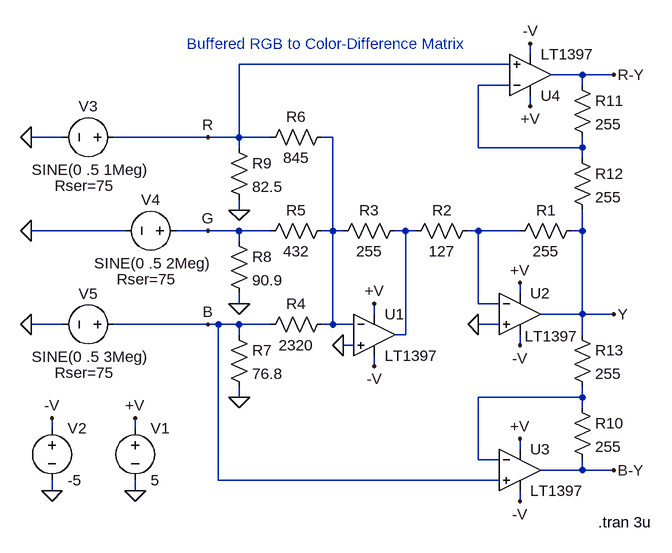
[diagram p0: schematic 1397.asc]
1397.asc, the LTspice schematic file:
Version 4
SHEET 1 1020 776
WIRE 400 -32 400 -48
WIRE 368 -16 -48 -16
WIRE 480 0 432 0
WIRE 528 0 480 0
WIRE 368 16 320 16
WIRE 480 16 480 0
WIRE 400 48 400 32
WIRE -320 96 -368 96
WIRE -96 96 -240 96
WIRE -48 96 -48 -16
WIRE -48 96 -96 96
WIRE 0 96 -48 96
WIRE 96 96 80 96
WIRE -48 112 -48 96
WIRE 320 112 320 16
WIRE 480 112 480 96
WIRE 480 112 320 112
WIRE 480 128 480 112
WIRE -48 208 -48 192
WIRE -224 240 -368 240
WIRE -96 240 -144 240
WIRE -48 240 -96 240
WIRE 0 240 -48 240
WIRE 96 240 96 96
WIRE 96 240 80 240
WIRE 112 240 96 240
WIRE 208 240 192 240
WIRE 224 240 208 240
WIRE 320 240 304 240
WIRE 384 240 320 240
WIRE 480 240 480 208
WIRE 480 240 464 240
WIRE -48 256 -48 240
WIRE 384 336 384 320
WIRE -48 352 -48 336
WIRE 320 352 320 240
WIRE 352 352 320 352
WIRE 160 368 160 352
WIRE 480 368 480 240
WIRE 480 368 416 368
WIRE 528 368 480 368
WIRE -320 384 -368 384
WIRE -96 384 -240 384
WIRE -80 384 -96 384
WIRE -48 384 -80 384
WIRE 0 384 -48 384
WIRE 96 384 96 240
WIRE 96 384 80 384
WIRE 128 384 96 384
WIRE 352 384 320 384
WIRE -48 400 -48 384
WIRE 208 400 208 240
WIRE 208 400 192 400
WIRE 480 400 480 368
WIRE 128 416 112 416
WIRE 384 416 384 400
WIRE 160 448 160 432
WIRE -48 496 -48 480
WIRE 480 496 480 480
WIRE 480 496 320 496
WIRE 480 512 480 496
WIRE -336 544 -336 528
WIRE -208 544 -208 528
WIRE 384 576 384 560
WIRE 320 592 320 496
WIRE 352 592 320 592
WIRE 480 608 480 592
WIRE 480 608 416 608
WIRE 528 608 480 608
WIRE -80 624 -80 384
WIRE 352 624 -80 624
WIRE -336 640 -336 624
WIRE -208 640 -208 624
WIRE 384 656 384 640
FLAG -208 640 0
FLAG 160 352 +V
FLAG -208 528 +V
FLAG 160 448 -V
FLAG -336 640 0
FLAG -336 528 -V
FLAG 384 320 +V
FLAG 384 416 -V
FLAG 384 560 +V
FLAG 384 656 -V
FLAG 400 48 +V
FLAG 400 -48 -V
FLAG 320 384 0
FLAG -48 496 0
FLAG -48 352 0
FLAG -48 208 0
FLAG -368 384 0
FLAG -368 240 0
FLAG -368 96 0
FLAG -96 96 R
FLAG -96 240 G
FLAG -96 384 B
FLAG 528 0 R-Y
FLAG 528 368 Y
FLAG 528 608 B-Y
FLAG 112 416 0
SYMBOL voltage -208 528 R0
SYMATTR InstName V1
SYMATTR Value 5
SYMBOL voltage -336 528 R0
SYMATTR InstName V2
SYMATTR Value -5
SYMBOL opamps\\LT1397 160 336 R0
SYMATTR InstName U1
SYMBOL opamps\\LT1397 384 304 R0
WINDOW 3 7 98 Left 0
SYMATTR InstName U2
SYMBOL opamps\\LT1397 384 544 R0
SYMATTR InstName U3
SYMBOL opamps\\LT1397 400 64 M180
SYMATTR InstName U4
SYMBOL res 480 224 R90
WINDOW 0 0 56 VBottom 0
WINDOW 3 32 56 VTop 0
SYMATTR InstName R1
SYMATTR Value 255
SYMBOL res 320 224 R90
WINDOW 0 0 56 VBottom 0
WINDOW 3 32 56 VTop 0
SYMATTR InstName R2
SYMATTR Value 127
SYMBOL res 208 224 R90
WINDOW 0 0 56 VBottom 0
WINDOW 3 32 56 VTop 0
SYMATTR InstName R3
SYMATTR Value 255
SYMBOL res 96 368 R90
WINDOW 0 0 56 VBottom 0
WINDOW 3 32 56 VTop 0
SYMATTR InstName R4
SYMATTR Value 2320
SYMBOL res 96 224 R90
WINDOW 0 0 56 VBottom 0
WINDOW 3 32 56 VTop 0
SYMATTR InstName R5
SYMATTR Value 432
SYMBOL res 96 80 R90
WINDOW 0 0 56 VBottom 0
WINDOW 3 32 56 VTop 0
SYMATTR InstName R6
SYMATTR Value 845
SYMBOL res -64 384 R0
SYMATTR InstName R7
SYMATTR Value 76.8
SYMBOL res -64 240 R0
SYMATTR InstName R8
SYMATTR Value 90.9
SYMBOL res -64 96 R0
SYMATTR InstName R9
SYMATTR Value 82.5
SYMBOL res 464 496 R0
SYMATTR InstName R10
SYMATTR Value 255
SYMBOL res 464 0 R0
SYMATTR InstName R11
SYMATTR Value 255
SYMBOL res 464 112 R0
SYMATTR InstName R12
SYMATTR Value 255
SYMBOL res 464 384 R0
SYMATTR InstName R13
SYMATTR Value 255
SYMBOL voltage -224 96 R90
WINDOW 0 -32 56 VBottom 0
WINDOW 3 34 53 VTop 0
WINDOW 39 59 62 VTop 0
SYMATTR InstName V3
SYMATTR Value SINE(0 .5 1Meg)
SYMATTR SpiceLine Rser=75
SYMBOL voltage -128 240 R90
WINDOW 0 -32 56 VBottom 0
WINDOW 3 34 53 VTop 0
WINDOW 39 59 62 VTop 0
SYMATTR InstName V4
SYMATTR Value SINE(0 .5 2Meg)
SYMATTR SpiceLine Rser=75
SYMBOL voltage -224 384 R90
WINDOW 0 -32 56 VBottom 0
WINDOW 3 34 53 VTop 0
WINDOW 39 59 62 VTop 0
WINDOW 123 0 0 Left 0
SYMATTR InstName V5
SYMATTR Value SINE(0 .5 3Meg)
SYMATTR SpiceLine Rser=75
TEXT 504 688 Left 0 !.tran 3u
TEXT 88 -32 Bottom 0 ;Buffered RGB to Color-Difference Matrix

The netlist it stands for:
* 1397.asc
V1 +V 0 5
V2 -V 0 -5
XU1 0 N002 +V -V N003 LT1397  ; pins In+ In- V+ V- OUT
XU2 0 N004 +V -V Y LT1397  ; pins In+ In- V+ V- OUT
XU3 B N005 +V -V B-Y LT1397  ; pins In+ In- V+ V- OUT
XU4 R N001 +V -V R-Y LT1397  ; pins In+ In- V+ V- OUT
R1 Y N004 255
R2 N004 N003 127
R3 N003 N002 255
R4 N002 B 2320
R5 N002 G 432
R6 N002 R 845
R7 B 0 76.8
R8 G 0 90.9
R9 R 0 82.5
R10 N005 B-Y 255
R11 R-Y N001 255
R12 N001 Y 255
R13 Y N005 255
V3 R 0 SINE(0 .5 1Meg) Rser=75
V4 G 0 SINE(0 .5 2Meg) Rser=75
V5 B 0 SINE(0 .5 3Meg) Rser=75
.tran 3u
* Buffered RGB to Color-Difference Matrix
.backanno
.end